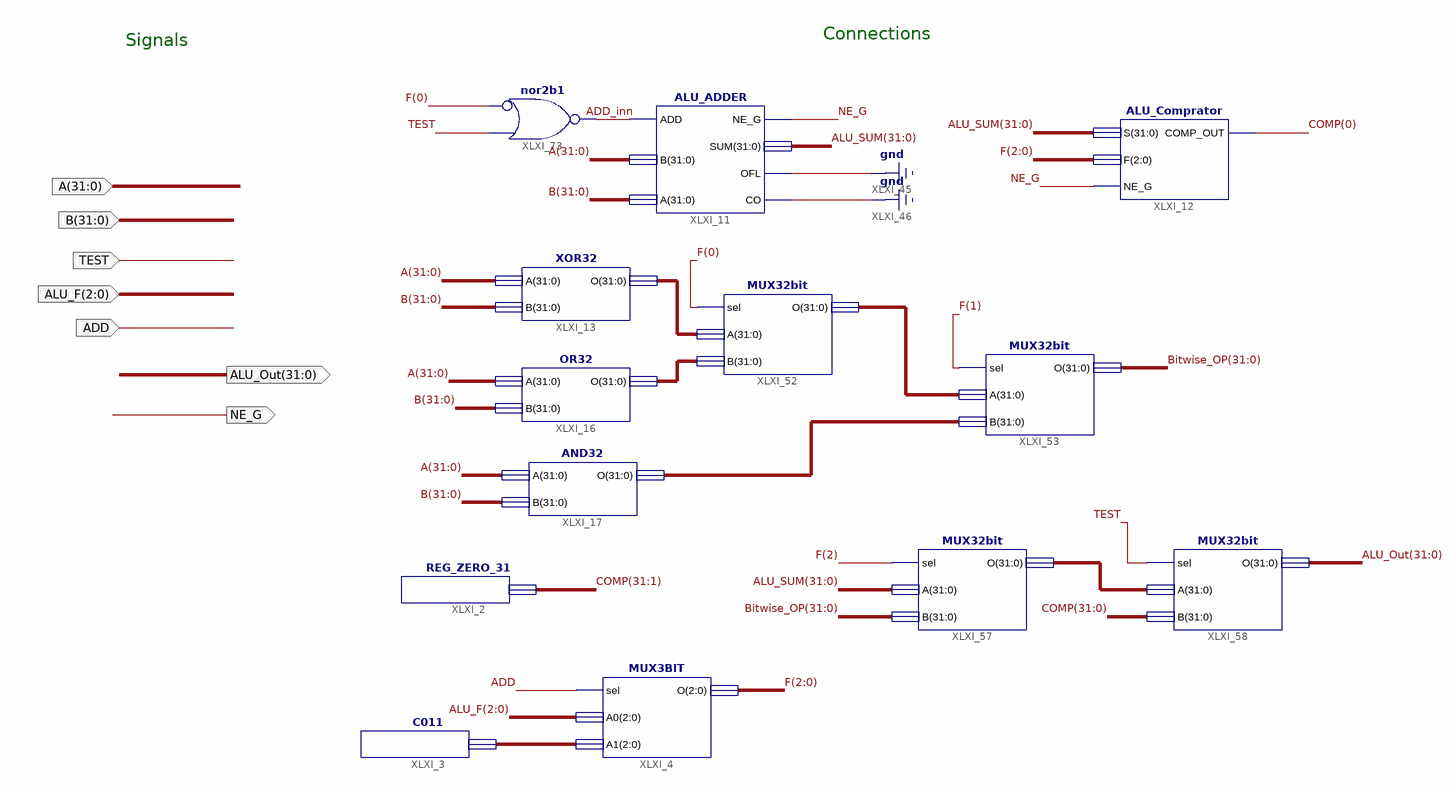
[diagram p0: schematic sheet 1]
// Xilinx ISE schematic ALU.sch (spartan6) as structural Verilog: 13 symbols, 7 ports
module ALU (
  input  [31:0] A,
  input  [31:0] B,
  input  TEST,
  input  [2:0] ALU_F,
  input  ADD,
  output [31:0] ALU_Out,
  output NE_G
);

  wire ADD_inn;
  wire [2:0] F, XLXN_9;
  wire [31:0] ALU_SUM, Bitwise_OP, COMP, XLXN_147, XLXN_148, XLXN_151, XLXN_152, XLXN_163;

  ALU_ADDER XLXI_11 (.ADD(ADD_inn), .B(A), .A(B), .NE_G(NE_G), .SUM(ALU_SUM), .OFL(1'b0), .CO(1'b0));
  ALU_Comprator XLXI_12 (.S(ALU_SUM), .F(F), .NE_G(NE_G), .COMP_OUT(COMP[0]));
  XOR32 XLXI_13 (.A(A), .B(B), .O(XLXN_147));
  OR32 XLXI_16 (.A(A), .B(B), .O(XLXN_148));
  AND32 XLXI_17 (.A(A), .B(B), .O(XLXN_151));
  MUX32bit XLXI_52 (.sel(F[0]), .A(XLXN_147), .B(XLXN_148), .O(XLXN_152));
  MUX32bit XLXI_53 (.sel(F[1]), .A(XLXN_152), .B(XLXN_151), .O(Bitwise_OP));
  REG_ZERO_31 XLXI_2 (.REG_Out(COMP[31:1]));
  C011 XLXI_3 (.C011_Out(XLXN_9));
  MUX3BIT XLXI_4 (.sel(ADD), .A0(ALU_F), .A1(XLXN_9), .O(F));
  MUX32bit XLXI_57 (.sel(F[2]), .A(ALU_SUM), .B(Bitwise_OP), .O(XLXN_163));
  MUX32bit XLXI_58 (.sel(TEST), .A(XLXN_163), .B(COMP), .O(ALU_Out));
  nor XLXI_73 (ADD_inn, ~F[0], TEST);  // nor2b1

  // Notes on the sheet:
  //   Connections
  //   Signals
endmodule
